# Altium schematic sheet Amplifier.SchDoc: Amplifier
size A4; DrawnBy: Sem Kirkels; DocumentNumber: 22-23P01S02; Revision: V1; SheetNumber: 2; SheetTotal: 5
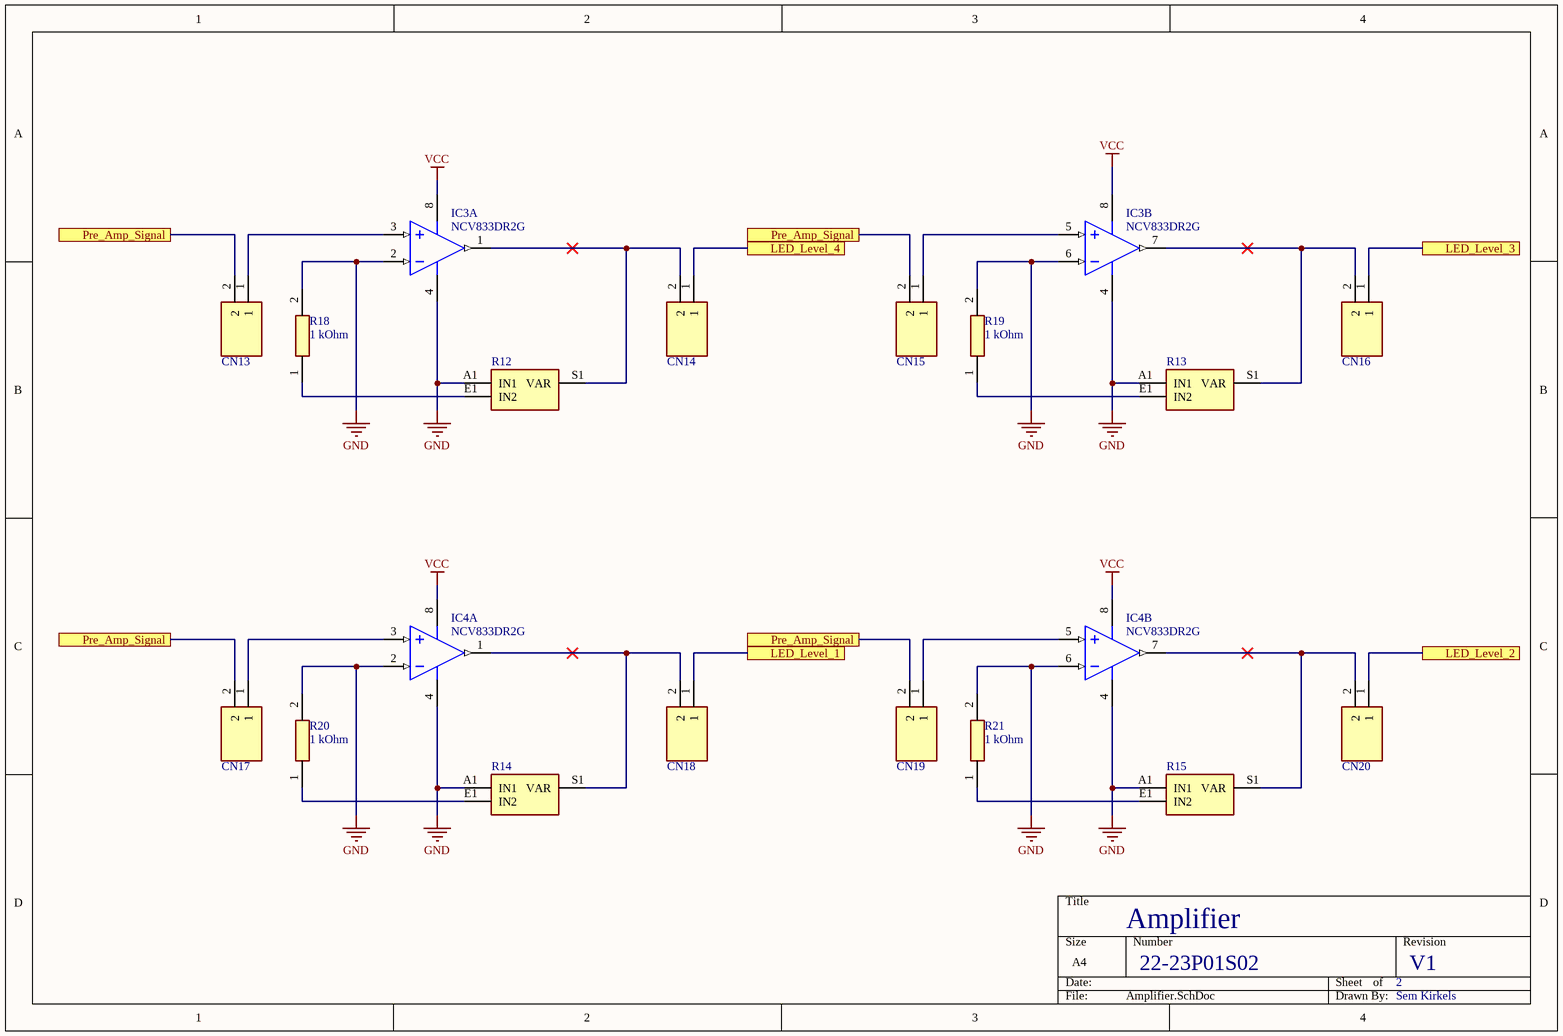
[diagram p0: Amplifier.SchDoc]

## Parts
CN13  2 Pin Header  [2 Pin Header]  (value not drawn)
CN14  2 Pin Header  [2 Pin Header]  (value not drawn)
CN15  2 Pin Header  [2 Pin Header]  (value not drawn)
CN16  2 Pin Header  [2 Pin Header]  (value not drawn)
CN17  2 Pin Header  [2 Pin Header]  (value not drawn)
CN18  2 Pin Header  [2 Pin Header]  (value not drawn)
CN19  2 Pin Header  [2 Pin Header]  (value not drawn)
CN20  2 Pin Header  [2 Pin Header]  (value not drawn)
IC3  NCV833DR2G  [Footprint Opamp]  (parts A,B of 2)
IC4  NCV833DR2G  [Footprint Opamp]  (parts A,B of 2)
R12  PT10LV10-202A2020-S  [Variable resistor]  (value not drawn)
R13  PT10LV10-202A2020-S  [Variable resistor]  (value not drawn)
R14  PT10LV10-202A2020-S  [Variable resistor]  (value not drawn)
R15  PT10LV10-202A2020-S  [Variable resistor]  (value not drawn)
R18  1 kOhm  [0805]
R19  1 kOhm  [0805]
R20  1 kOhm  [0805]
R21  1 kOhm  [0805]

## Ports
LED_Level_1 (see Indicators[2B]), LED_Level_2 (see Indicators[2B]), LED_Level_3 (see Indicators[2B]), LED_Level_4 (see Indicators[2B]), Pre_Amp_Signal (see Amplifier[1A], Amplifier[1C], Amplifier[2A], Pre_Amplifier[3B]), Pre_Amp_Signal (see Amplifier[1A], Amplifier[1C], Amplifier[2C], Pre_Amplifier[3B]), Pre_Amp_Signal (see Amplifier[1A], Amplifier[2A], Amplifier[2C], Pre_Amplifier[3B]), Pre_Amp_Signal (see Amplifier[1C], Amplifier[2A], Amplifier[2C], Pre_Amplifier[3B])

## Nets
GND: IC3.2(IN1-) IC3.4(VEE) IC3.6(IN2-) IC4.2(IN1-) IC4.4(VEE) IC4.6(IN2-) R12.A1(IN1) R13.A1(IN1) R14.A1(IN1) R15.A1(IN1) R18.2 R19.2 R20.2 R21.2
VCC: IC3.8(VCC) IC4.8(VCC)
LED_Level_1: CN18.1 ; port LED_Level_1
LED_Level_2: CN20.1 ; port LED_Level_2
LED_Level_3: CN16.1 ; port LED_Level_3
LED_Level_4: CN14.1 ; port LED_Level_4
Pre_Amp_Signal: CN13.2 CN15.2 CN17.2 CN19.2 ; port Pre_Amp_Signal
NetCN13_1: CN13.1 IC3.3(IN1+)
NetCN14_2: CN14.2 IC3.1(OUT1) R12.S1(VAR)
NetCN15_1: CN15.1 IC3.5(IN2+)
NetCN16_2: CN16.2 IC3.7(OUT2) R13.S1(VAR)
NetCN17_1: CN17.1 IC4.3(IN1+)
NetCN18_2: CN18.2 IC4.1(OUT1) R14.S1(VAR)
NetCN19_1: CN19.1 IC4.5(IN2+)
NetCN20_2: CN20.2 IC4.7(OUT2) R15.S1(VAR)
NetR12_E1: R12.E1(IN2) R18.1
NetR13_E1: R13.E1(IN2) R19.1
NetR14_E1: R14.E1(IN2) R20.1
NetR15_E1: R15.E1(IN2) R21.1

## Library data of the parts
CN13-CN20 = 2 Pin Header: Connector; Manufacturer_Name: TE Connectivity; Manufacturer_Part_Number: 5-146284-2; Datasheet Link: https://componentsearchengine.com/Datasheets/1/5-146284-2.pdf; Height: 8.21mm; Mouser Part Number: 571-5-146284-2; Mouser Price/Stock: https://www.mouser.co.uk/ProductDetail/TE-Connectivity/5-146284-2?qs=26tC0AmtfJgTF4M3cEQgiA%3D%3D; Arrow Part Number: 5-146284-2; Arrow Price/Stock: https://www.arrow.com/en/products/5-146284-2/te-connectivity
IC3 IC4 = Opamp: Low Noise, Audio Dual Operational Amplifier, -40 to 85 degC, 8-Pin SOIC, Pb-Free, Tape and Reel; Manufacturer: On Semiconductor; SR Typ (V/uS): 7; GBW Typ (MHz): 15; RoHS: TRUE; ComponentLink2URL: http://www.onsemi.cn/pub_link/Collateral/LM833-D.PDF; ComponentLink1Description: Manufacturer URL; ComponentLink3Description: Package Specification; Mounting Technology: Surface Mount; Packing: Tape and Reel; ComponentLink3URL: http://www.onsemi.com/pub_link/Collateral/751-07.PDF; DatasheetVersion: Rev. 6; ComponentLink1URL: http://www.onsemi.com/; PackageDescription: 8-Pin Small Outline Integrated Circuit, Body 4.9 x 3.9 mm, Pitch 1.27 mm; PackageReference: SOIC-8-751-07; PartNumber: NCV833DR2G; PackageVersion: Rev. AK, 02/2011; ComponentLink2Description: Datasheet
R12-R15 = PT10LV10-202A2020-S: Variable Resistor; Manufacturer_Name: PIHER; Datasheet Link: https://www.piher.net/pdf/12-PT10v03.pdf; Height: 6.2mm; Manufacturer_Part_Number: PT10LV10-202A2020-S; Mouser Part Number: 531-PT10V-2K-S; Mouser Price/Stock: https://www.mouser.co.uk/ProductDetail/Amphenol-Piher/PT10LV10-202A2020-S?qs=pCZPOPZMYPhb8H8I5oW3PQ%3D%3D
R18-R21 = Resistor: Manufacturer_Name: YAGEO; Manufacturer_Part_Number: RP0805BRD071KL; Datasheet Link: https://www.yageo.com/upload/media/product/products/datasheet/rchip/PYu-RP_51_RoHS_L_0.pdf; Height: 0.6mm; Mouser Part Number: 603-RP0805BRD071KL; Mouser Price/Stock: https://www.mouser.co.uk/ProductDetail/YAGEO/RP0805BRD071KL?qs=Y0Uzf4wQF3m8mAbG54g63Q%3D%3D